# Altium schematic sheet ICs.SchDoc
size A
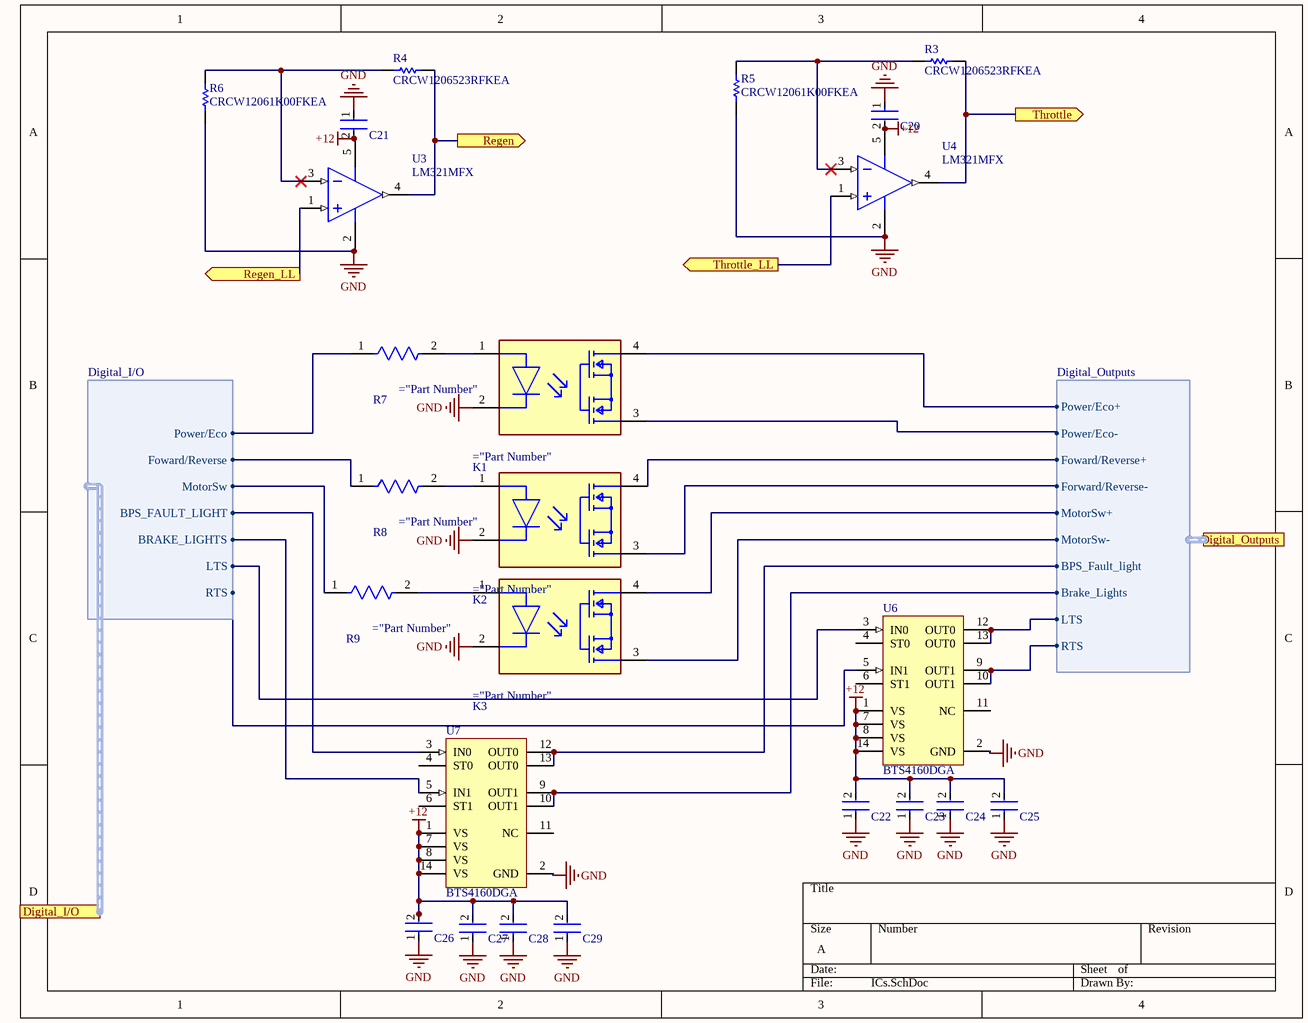
[diagram p0: ICs.SchDoc]

## Parts
C20  C0603C104K5RACTU  [Kemet_C0603_IPC_A]  (value not drawn)
C21  C0603C104K5RACTU  [Kemet_C0603_IPC_A]  (value not drawn)
C22  C0603C104K5RACTU  [Kemet_C0603_IPC_A]  (value not drawn)
C23  C0603C104K5RACTU  [Kemet_C0603_IPC_A]  (value not drawn)
C24  C0603C104K5RACTU  [Kemet_C0603_IPC_A]  (value not drawn)
C25  C0603C104K5RACTU  [Kemet_C0603_IPC_A]  (value not drawn)
C26  C0603C104K5RACTU  [Kemet_C0603_IPC_A]  (value not drawn)
C27  C0603C104K5RACTU  [Kemet_C0603_IPC_A]  (value not drawn)
C28  C0603C104K5RACTU  [Kemet_C0603_IPC_A]  (value not drawn)
C29  C0603C104K5RACTU  [Kemet_C0603_IPC_A]  (value not drawn)
K1  CPC1008N  [IXYS_CPC1008N_IPC_C]  (value not drawn)
K2  CPC1008N  [IXYS_CPC1008N_IPC_C]  (value not drawn)
K3  CPC1008N  [IXYS_CPC1008N_IPC_C]  (value not drawn)
R3  CRCW1206523RFKEA  [RESC3216X60X45NL10T20]
R4  CRCW1206523RFKEA  [RESC3216X60X45NL10T20]
R5  CRCW12061K00FKEA  [RESC3216X60X45ML15T20]
R6  CRCW12061K00FKEA  [RESC3216X60X45ML15T20]
R7  RK73H2BTTD3320F  [KOA_Speer_RK73H2B_IPC_A]  (value not drawn)
R8  RK73H2BTTD3320F  [KOA_Speer_RK73H2B_IPC_A]  (value not drawn)
R9  RK73H2BTTD3320F  [KOA_Speer_RK73H2B_IPC_A]  (value not drawn)
U3  LM321MFX  [DBV0005A_L]
U4  LM321MFX  [DBV0005A_L]
U6  BTS4160DGA  [INF-PG-DSO-14-37_M]
U7  BTS4160DGA  [INF-PG-DSO-14-37_M]

## Ports
Digital_I/O (harness Digital_I/O), Digital_Outputs (harness Digital_Outputs), Regen (out), Regen_LL (out), Throttle (out), Throttle_LL (out)

## Harnesses
Digital_Outputs: BPS_Fault_light, Brake_Lights, Forward/Reverse-, Foward/Reverse+, LTS, MotorSw-, MotorSw+, Power/Eco-, Power/Eco+, RTS
Digital_I/O: BPS_FAULT_LIGHT, BRAKE_LIGHTS, LTS, MotorSw, Power/Eco, RTS, Foward/Reverse

## Nets
+12: C20.2 C21.2 C22.2 C23.2 C24.2 C25.2 C26.2 C27.2 C28.2 C29.2 U3.5(V+) U4.5(V+) U6.1(VS) U6.7(VS) U6.8(VS) U6.14(VS) U7.1(VS) U7.7(VS) U7.8(VS) U7.14(VS)
GND: C20.1 C21.1 C22.1 C23.1 C24.1 C25.1 C26.1 C27.1 C28.1 C29.1 K1.2(-Control) K2.2(-Control) K3.2(-Control) R5.2 R6.2 U3.2(V-) U4.2(V-) U6.2(GND) U7.2(GND)
Regen: R4.1 U3.4(OUT) ; port Regen
Regen_LL: U3.1(IN+) ; port Regen_LL
Throttle: R3.1 U4.4(OUT) ; port Throttle
Throttle_LL: U4.1(IN+) ; port Throttle_LL
NetK1_1: K1.1(+Control) R7.2
NetK1_3: K1.3(1_Load) ; port Digital_Outputs.Power/Eco-
NetK1_4: K1.4(2_Load) ; port Digital_Outputs.Power/Eco+
NetK2_1: K2.1(+Control) R8.2
NetK2_3: K2.3(1_Load) ; port Digital_Outputs.Forward/Reverse-
NetK2_4: K2.4(2_Load) ; port Digital_Outputs.Foward/Reverse+
NetK3_1: K3.1(+Control) R9.2
NetK3_3: K3.3(1_Load) ; port Digital_Outputs.MotorSw-
NetK3_4: K3.4(2_Load) ; port Digital_Outputs.MotorSw+
NetR3_2: R3.2 R5.1 U4.3(IN-)
NetR4_2: R4.2 R6.1 U3.3(IN-)
NetR7_1: R7.1 ; port Digital_I/O.Power/Eco
NetR8_1: R8.1 ; port Digital_I/O.Foward/Reverse
NetR9_1: R9.1 ; port Digital_I/O.MotorSw
NetU6_3: U6.3(IN0) ; port Digital_I/O.LTS
NetU6_5: U6.5(IN1) ; port Digital_I/O.RTS
NetU6_9: U6.9(OUT1) U6.10(OUT1) ; port Digital_Outputs.RTS
NetU6_12: U6.12(OUT0) U6.13(OUT0) ; port Digital_Outputs.LTS
NetU7_3: U7.3(IN0) ; port Digital_I/O.BPS_FAULT_LIGHT
NetU7_5: U7.5(IN1) ; port Digital_I/O.BRAKE_LIGHTS
NetU7_9: U7.9(OUT1) U7.10(OUT1) ; port Digital_Outputs.Brake_Lights
NetU7_12: U7.12(OUT0) U7.13(OUT0) ; port Digital_Outputs.BPS_Fault_light

Not connected (* = marked no-connect by the designer): U6 4(ST0) 6(ST1) 11(NC); U7 4(ST0) 6(ST1) 11(NC)

## Library data of the parts
C20-C29 = C0603C104K5RACTU: CAP CER 0.1UF 100NF 50V X7R 0603
R3 R4 = CMP-2003-02266-1: 523Ohm; Manufacturer: Vishay Dale; Part Number: CRCW1206523RFKEA
R5 R6 = CMP-2100-03616-1: Chip Resistor, 1 KOhm, +/- 1%, 0.25 W, -55 to 155 degC, 1206 (3216 Metric), RoHS, Tape and Reel; Manufacturer: Vishay Semiconductor; Power Rating: 250mW; Voltage Rating (DC): 200V; Resistance: 1KOhm; Temperature Coefficient: 100ppm/degreesC; Case Code (Imperial): 1206; Length: 3.2mm; Case/Package: 1206; Contact Plating: Tin; Package Quantity: 10; Datasheet URL: http://www.farnell.com/datasheets/1720486.pdf; Mount: SurfaceMount; Package Description: 2-Pin Surface Mount Device, Body 3.15 x 1.6 mm; Package Reference: 1206.0; Max Operating Temperature: 155degC; Lead Free: LeadFree; Weight: 0.000353oz; Military Standard: Not; Max Power Dissipation: 250mW; Case Code (Metric): 3216; Number of Terminations: 2; Tolerance: 1%; Width: 0.063inch; Termination: SMD/SMT; Number of Pins: 2; Min Operating Temperature: -55degC; Height: 0.55mm; Depth: 1.6mm; RoHSCompliant: true; Composition: ThickFilm; Packaging: TapeandReel; Manufacturer URL: http://www.vishay.com/; Voltage Rating: 200V; Radiation Hardening: No; REACH SVHC: Unknown; Datasheet Version: 41061.0
R7-R9 = RK73H2BTTD3320F: 332Ohm
U3 U4 = CMP-0055-01337-3: Low Power Single Op Amp, 5-pin SOT-23; Manufacturer: Texas Instruments; PowerWise: N; CompType: Amplifiers; PackageTopMarking: A63A*XTT; ComponentLink1Description: Datasheet URL; PackageDescription: Molded SOT-23, .115 x .063 x .040 in Body, 5 Lead, .0375 in Pitch; PinCount: 5; ComponentLink1URL: http://www.ti.com/general/docs/lit/getliterature.tsp?genericPartNumber=LM321&fileType=pdf; RoHS: N; Package Reference: DBV0005A
U6 U7 = BTS4160DGA: Smart High-Side Power Switch, 2 Channels, 1.7 A Load Current, -40 to 150 degC, PG-DSO-14-37, Reel, Green; Manufacturer: Infineon; Group: Automotive Qualified; RON(max) @ 150degreesC: 320 mOhm; Recommended Operating Voltage Min.: 5.5 V; Recommended Operating Voltage Max.: 20 V; Green: TRUE; toff (max): 270 us; Load Current (typ): 1.7 A; ton (max): 250 us; RON @ 25degreesC: 160 mOhm; Ptot (max): 1.4 W; Channels: 2; PartNumber: BTS4160DGA; ComponentLink1Description: Manufacturer URL; ComponentLink2Description: Datasheet; DatasheetVersion: Rev. 1.0; ComponentLink3URL: http://www.infineon.com/dgdl/BTS723GWDS11_2007_09_25.pdf?folderId=db3a304314dca389011537739e37155f&fileId=db3a304331c8f8560131dbfec21b0da9&sId=db3a30443d67b5ca013d854df2f133e5; ComponentLink1URL: http://www.infineon.com/; Packing: Reel; ComponentLink2URL: http://www.infineon.com/dgdl/BTS+4160DGA_DS2008_03_18_neu.pdf?folderId=db3a304314dca389011537739e37155f&fileId=db3a30431a5c32f2011a957ab5875685&sId=db3a30433d68e984013d7cba76cc57cb; ComponentLink3Description: Package Specification; PackageVersion: Sep-07; Halogen-free: TRUE; Mounting Technology: Surface Mount; PackageReference: PG-DSO-14-37; PackageDescription: 14-Pin Plastic (Green) Dual Small Outline Package, 8.65 x 3.9 mm Body, 1.27 mm Pitch